# Altium schematic sheet M0.SchDoc
size A3; DocumentNumber: 1; SheetNumber: 1; SheetTotal: 8
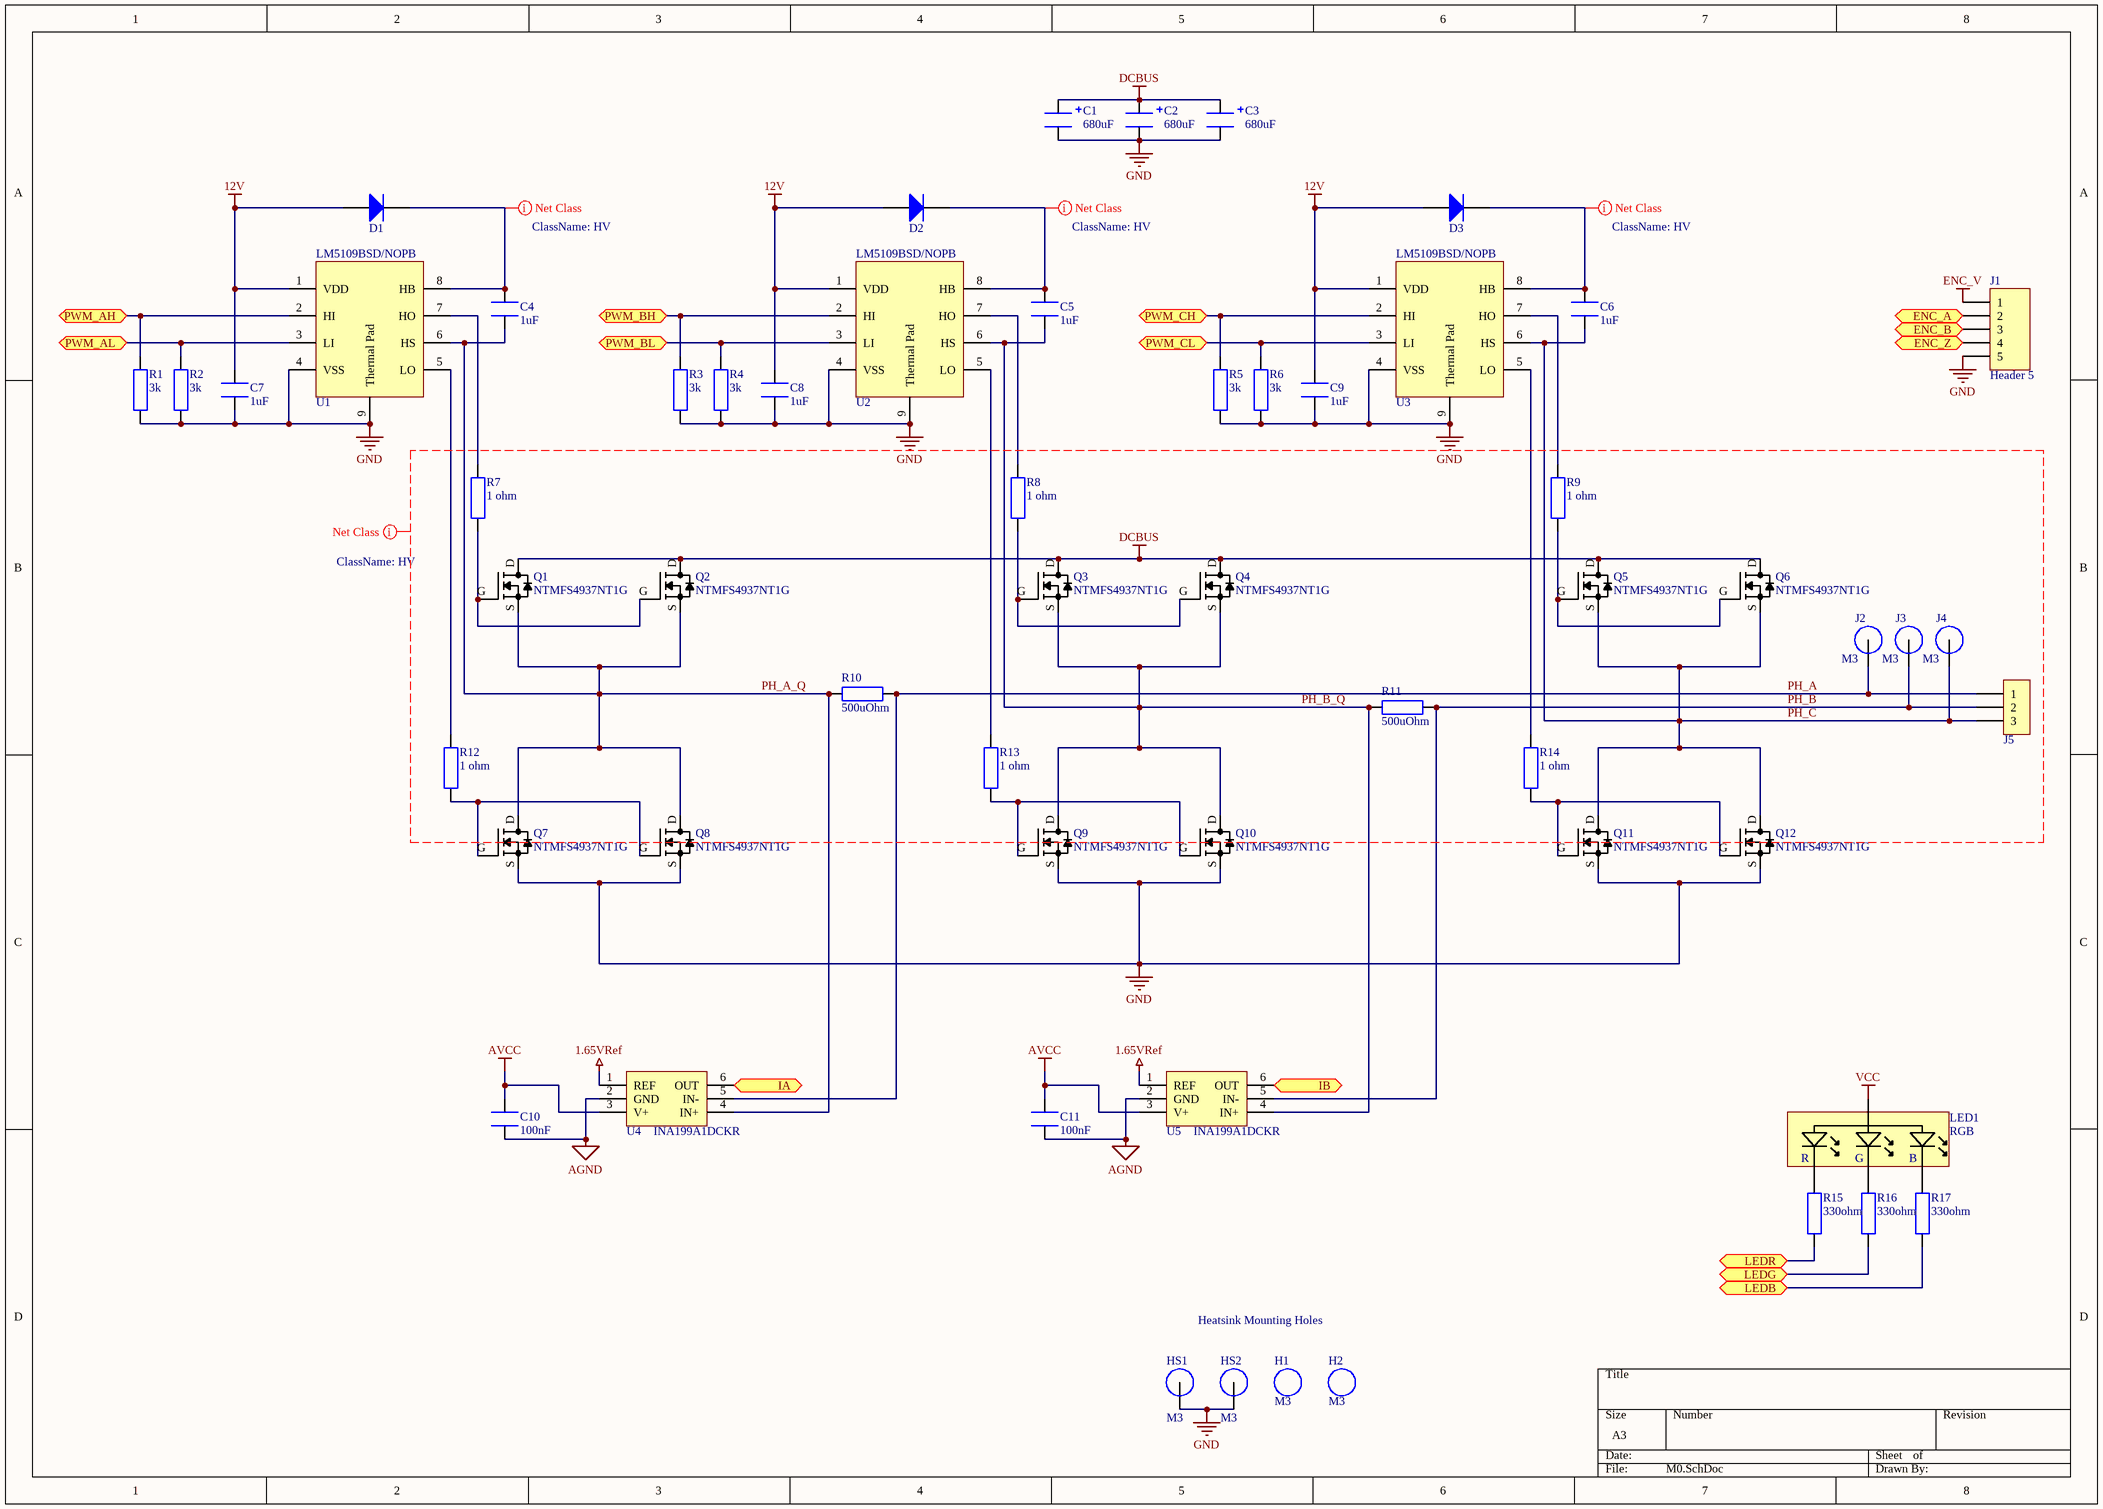
[diagram p0: M0.SchDoc]

## Parts
C1  value 680uF  [CAPE10.0MM_Rad_10x14mm]  (hidden comment: 35ZLH680MEFC10X23)
C2  value 680uF  [CAPE10.0MM_Rad_10x14mm]  (hidden comment: 35ZLH680MEFC10X23)
C3  value 680uF  [CAPE10.0MM_Rad_10x14mm]  (hidden comment: 35ZLH680MEFC10X23)
C4  value 1uF  [1608[0603]]  (hidden comment: MC0603X105K160)
C5  value 1uF  [1608[0603]]  (hidden comment: MC0603X105K160)
C6  value 1uF  [1608[0603]]  (hidden comment: MC0603X105K160)
C7  value 1uF  [1608[0603]]  (hidden comment: MC0603X105K160)
C8  value 1uF  [1608[0603]]  (hidden comment: MC0603X105K160)
C9  value 1uF  [1608[0603]]  (hidden comment: MC0603X105K160)
C10  value 100nF  [1608[0603]]  (hidden comment: MC0603B104K160CT)
C11  value 100nF  [1608[0603]]  (hidden comment: MC0603B104K160CT)
D1  RB521S30T1G  [SOD523F]  (value not drawn)
D2  RB521S30T1G  [SOD523F]  (value not drawn)
D3  RB521S30T1G  [SOD523F]  (value not drawn)
H1  M3  [M3 Hole]
H2  M3  [M3 Hole]
HS1  M3  [M3 Mounting Hole]
HS2  M3  [M3 Mounting Hole]
J1  Header 5  [HDR1X5]
J2  M3  [M3 Spade Hole]
J3  M3  [M3 Spade Hole]
J4  M3  [M3 Spade Hole]
J5  MC000051  [MC000051]  (value not drawn)
LED1  RGB  [ASMB-MTB1]
Q1  NTMFS4937NT1G  [SO8FL_FILL]
Q2  NTMFS4937NT1G  [SO8FL_FILL]
Q3  NTMFS4937NT1G  [SO8FL_FILL]
Q4  NTMFS4937NT1G  [SO8FL_FILL]
Q5  NTMFS4937NT1G  [SO8FL_FILL]
Q6  NTMFS4937NT1G  [SO8FL_FILL]
Q7  NTMFS4937NT1G  [SO8FL_FILL]
Q8  NTMFS4937NT1G  [SO8FL_FILL]
Q9  NTMFS4937NT1G  [SO8FL_FILL]
Q10  NTMFS4937NT1G  [SO8FL_FILL]
Q11  NTMFS4937NT1G  [SO8FL_FILL]
Q12  NTMFS4937NT1G  [SO8FL_FILL]
R1  value 3k  [RESC1608X55N]  (hidden comment: MCMR06X3001FTL)
R2  value 3k  [RESC1608X55N]  (hidden comment: MCMR06X3001FTL)
R3  value 3k  [RESC1608X55N]  (hidden comment: MCMR06X3001FTL)
R4  value 3k  [RESC1608X55N]  (hidden comment: MCMR06X3001FTL)
R5  value 3k  [RESC1608X55N]  (hidden comment: MCMR06X3001FTL)
R6  value 3k  [RESC1608X55N]  (hidden comment: MCMR06X3001FTL)
R7  value 1 ohm  [RESC1608X55N]  (hidden comment: MCWR06W1R00FTL)
R8  value 1 ohm  [RESC1608X55N]  (hidden comment: MCWR06W1R00FTL)
R9  value 1 ohm  [RESC1608X55N]  (hidden comment: MCWR06W1R00FTL)
R10  value 500uOhm  [RESC6332X70N]  (hidden comment: TLR3A20DR0005FTDG)
R11  value 500uOhm  [RESC6332X70N]  (hidden comment: TLR3A20DR0005FTDG)
R12  value 1 ohm  [RESC1608X55N]  (hidden comment: MCWR06W1R00FTL)
R13  value 1 ohm  [RESC1608X55N]  (hidden comment: MCWR06W1R00FTL)
R14  value 1 ohm  [RESC1608X55N]  (hidden comment: MCWR06W1R00FTL)
R15  value 330ohm  [RESC1608X06L]  (hidden comment: MCWR06X3300FTL)
R16  value 330ohm  [RESC1608X06L]  (hidden comment: MCWR06X3300FTL)
R17  value 330ohm  [RESC1608X06L]  (hidden comment: MCWR06X3300FTL)
U1  LM5109BSD/NOPB  [SON80P400X80_HS-9N]
U2  LM5109BSD/NOPB  [SON80P400X80_HS-9N]
U3  LM5109BSD/NOPB  [SON80P400X80_HS-9N]
U4  INA199A1DCKR  [TSOP65P210X110-6N]
U5  INA199A1DCKR  [TSOP65P210X110-6N]

## Ports
ENC_A, ENC_B, ENC_Z, IA, IB, LEDB, LEDG, LEDR, PWM_AH, PWM_AL, PWM_BH, PWM_BL, PWM_CH, PWM_CL

## Nets
1.65VRef: U4.1(REF) U5.1(REF)
12V: C7.2 C8.2 C9.2 D1.A D2.A D3.A U1.1(VDD) U2.1(VDD) U3.1(VDD)
AGND: C10.1 C11.1 U4.2(GND) U5.2(GND)
AVCC: C10.2 C11.2 U4.3(V+) U5.3(V+)
DCBUS: C1.1 C2.1 C3.1 Q1.D Q2.D Q3.D Q4.D Q5.D Q6.D
ENC_V: J1.1
GND: C1.2 C2.2 C3.2 C7.1 C8.1 C9.1 HS1.1 HS2.1 J1.5 Q7.S Q8.S Q9.S Q10.S Q11.S Q12.S R1.1 R2.1 R3.1 R4.1 R5.1 R6.1 U1.4(VSS) U1.9(Thermal_Pad) U2.4(VSS) U2.9(Thermal_Pad) U3.4(VSS) U3.9(Thermal_Pad)
VCC: LED1.4(A)
ENC_A: J1.2 ; port ENC_A
ENC_B: J1.3 ; port ENC_B
ENC_Z: J1.4 ; port ENC_Z
IA: U4.6(OUT) ; port IA
IB: U5.6(OUT) ; port IB
LEDB: R17.2 ; port LEDB
LEDG: R16.2 ; port LEDG
LEDR: R15.2 ; port LEDR
PH_A: J2.1 J5.1 R10.1 U4.5(IN-)
PH_A_Q: C4.1 Q1.S Q2.S Q7.D Q8.D R10.2 U1.6(HS) U4.4(IN+)
PH_B: J3.1 J5.2 R11.1 U5.5(IN-)
PH_B_Q: C5.1 Q3.S Q4.S Q9.D Q10.D R11.2 U2.6(HS) U5.4(IN+)
PH_C: C6.1 J4.1 J5.3 Q5.S Q6.S Q11.D Q12.D U3.6(HS)
PWM_AH: R1.2 U1.2(HI) ; port PWM_AH
PWM_AL: R2.2 U1.3(LI) ; port PWM_AL
PWM_BH: R3.2 U2.2(HI) ; port PWM_BH
PWM_BL: R4.2 U2.3(LI) ; port PWM_BL
PWM_CH: R5.2 U3.2(HI) ; port PWM_CH
PWM_CL: R6.2 U3.3(LI) ; port PWM_CL
NetC4_2: C4.2 D1.K U1.8(HB)
NetC5_2: C5.2 D2.K U2.8(HB)
NetC6_2: C6.2 D3.K U3.8(HB)
NetLED1_1: LED1.1(R) R15.1
NetLED1_2: LED1.2(G) R16.1
NetLED1_3: LED1.3(B) R17.1
NetQ1_G: Q1.G Q2.G R7.1
NetQ3_G: Q3.G Q4.G R8.1
NetQ5_G: Q5.G Q6.G R9.1
NetQ7_G: Q7.G Q8.G R12.1
NetQ9_G: Q9.G Q10.G R13.1
NetQ11_G: Q11.G Q12.G R14.1
NetR7_2: R7.2 U1.7(HO)
NetR8_2: R8.2 U2.7(HO)
NetR9_2: R9.2 U3.7(HO)
NetR12_2: R12.2 U1.5(LO)
NetR13_2: R13.2 U2.5(LO)
NetR14_2: R14.2 U3.5(LO)

## Layout directives
net class HV: DCBUS, NetC4_2, NetC5_2, NetC6_2, PH_A, PH_A_Q, PH_B, PH_B_Q, PH_C

## Notes on the sheet
- Heatsink Mounting Holes

## Library data of the parts
C1-C3 = 35ZLH680MEFC10X23: CAP, ALU ELEC, 680UF, 35V, RAD; Supplier 1: Farnell; Supplier Part Number 1: 8126771
C4-C9 = MC0603X105K160: CAP, MLCC, X5R, 1UF, 16V, 0603; Supplier 1: Farnell; Supplier Part Number 1: 2310630; Supplier 2: Farnell; Supplier Part Number 2: 1759407RL; Supplier 3: Farnell; Supplier Part Number 3: 1759407
C10 C11 = MC0603B104K160CT: CAP, MLCC, X7R, 100NF, 16V, 0603; Supplier 1: Farnell; Supplier Part Number 1: 2310628; Supplier 2: Farnell; Supplier Part Number 2: 1759016RL; Supplier 3: Farnell; Supplier Part Number 3: 1759016
D1-D3 = RB521S30T1G: DIODE, SCHOTTKY, 200MA, 30V; Supplier 1: Farnell; Supplier Part Number 1: 2317433
H1 H2 = M3 Hole: M3 Hole with no copper
HS1 HS2 = M3 Mounting Hole
J1 = Header 5: Header, 5-Pin; LatestRevisionDate: 17-Jul-2002; LatestRevisionNote: Re-released for DXP Platform.; Publisher: Altium Limited
J2-J4 = M3 Spade Terminal
J5 = MC000051: TERMINAL BLOCK, WIRE TO BRD, 3POS, 10AWG; Supplier 1: Farnell; Supplier Part Number 1: 2008022
LED1 = ASMB-MTB1-0A3A2: LED, HB, RGB, 0.09W, PLCC-4; Supplier 1: Farnell; Supplier Part Number 1: 2401106
Q1-Q12 = NTMFS4937NT1G: MOSFET, N CH, 30V, 70A, SO-8 FL; Supplier 1: Farnell; Supplier Part Number 1: 2317605; Supplier 2: Farnell; Supplier Part Number 2: 2317605RL
R1-R6 = MCMR06X3001FTL: RESISTOR, 0603, 3K, 1%, ANTI SULFUR; Supplier 1: Farnell; Supplier Part Number 1: 2073461; Supplier 2: Farnell; Supplier Part Number 2: 2073461RL
R7-R9 R12-R14 = MCWR06W1R00FTL: RES, THICK FILM, 1OHM, 1%, 0.1W; Supplier 1: Farnell; Supplier 2: Farnell; Supplier Part Number 1: 2447289; Supplier Part Number 2: 2447289RL
R10 R11 = TLR3A20DR0005FTDG: RESISTOR, R0005, 2.0W, 1%
R15-R17 = MCWR06X3300FTL: RES, THICK FILM, 330 OHM, 1%, 0.1W; Supplier 1: Farnell; Supplier Part Number 1: 2447339RL; Supplier 2: Farnell; Supplier Part Number 2: 2446656; Supplier 3: Farnell; Supplier Part Number 3: 2447339
U1-U3 = LM5109BSD/NOPB: DRIVER, MOSFET, HALF BRIDGE, WSON-8, 1A; Supplier 1: Farnell; Supplier Part Number 1: 2400642RL; Supplier 2: Farnell; Supplier Part Number 2: 2400642; Supplier 3: Farnell; Supplier Part Number 3: 2382850
U4 U5 = INA199A1DCKR: CURRENT SENSE AMP, 50V/V, 80KHZ; Supplier 1: Digi-Key; Supplier Part Number 1: 296-27329-1-ND; Supplier 2: Mouser; Supplier Part Number 2: 595-INA199B1DCKT